# Altium schematic sheet sensorsAndExecutiveElements.SchDoc
size A4
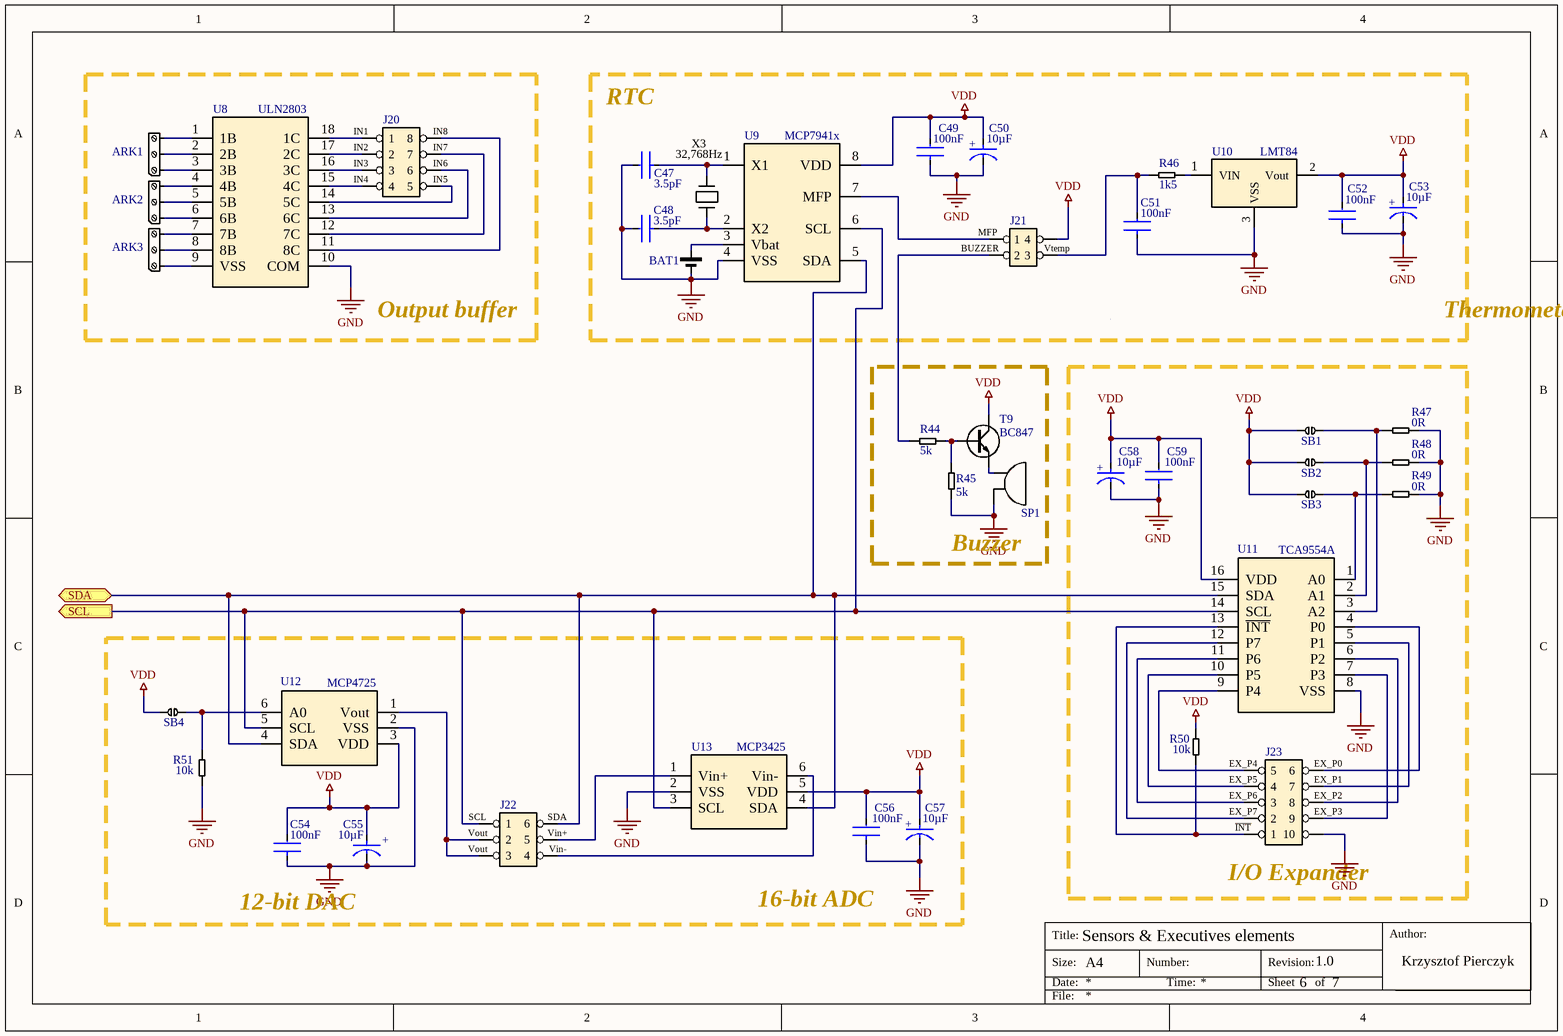
[diagram p0: sensorsAndExecutiveElements.SchDoc]

## Parts
ARK1  ARK-3  [ARK3]  (value not drawn)
ARK2  ARK-3  [ARK3]  (value not drawn)
ARK3  ARK-3  [ARK3]  (value not drawn)
BAT1  Battery  [CR2032 Holder (botland)]  (value not drawn)
C47  value 3.5pF  [FP-C0805C-DN-MFG]  (hidden comment: C0805C102J5GACTU)
C48  value 3.5pF  [FP-C0805C-DN-MFG]  (hidden comment: C0805C102J5GACTU)
C49  value 100nF  [FP-C0805C-DN-MFG]  (hidden comment: C0805C102J5GACTU)
C50  Capacitance: 10µF  [FP-F98S-MFG]  (hidden comment: F981C106MSAAS1)
C51  value 100nF  [FP-C0805C-DN-MFG]  (hidden comment: C0805C102J5GACTU)
C52  value 100nF  [FP-C0805C-DN-MFG]  (hidden comment: C0805C102J5GACTU)
C53  Capacitance: 10µF  [FP-F98S-MFG]  (hidden comment: F981C106MSAAS1)
C54  value 100nF  [FP-C0805C-DN-MFG]  (hidden comment: C0805C102J5GACTU)
C55  Capacitance: 10µF  [FP-F98S-MFG]  (hidden comment: F981C106MSAAS1)
C56  value 100nF  [FP-C0805C-DN-MFG]  (hidden comment: C0805C102J5GACTU)
C57  Capacitance: 10µF  [FP-F98S-MFG]  (hidden comment: F981C106MSAAS1)
C58  Capacitance: 10µF  [FP-F98S-MFG]  (hidden comment: F981C106MSAAS1)
C59  value 100nF  [FP-C0805C-DN-MFG]  (hidden comment: C0805C102J5GACTU)
J20  Header 2x4  [Header 2x4]  (value not drawn)
J21  Header 2x2  [Header 2x2]  (value not drawn)
J22  Header 2x3  [Header 2x3]  (value not drawn)
J23  Header 2x5  [Header2x5]  (value not drawn)
R44  Resistance: 5k  [0805]  (hidden comment: Resistor)
R45  Resistance: 5k  [0805]  (hidden comment: Resistor)
R46  Resistance: 1k5  [0805]  (hidden comment: Resistor)
R47  Resistance: 0R  [0805]  (hidden comment: Resistor)
R48  Resistance: 0R  [0805]  (hidden comment: Resistor)
R49  Resistance: 0R  [0805]  (hidden comment: Resistor)
R50  Resistance: 10k  [0805]  (hidden comment: Resistor)
R51  Resistance: 10k  [0805]  (hidden comment: Resistor)
SB1  Bridge  [0805]  (value not drawn)
SB2  Bridge  [0805]  (value not drawn)
SB3  Bridge  [0805]  (value not drawn)
SB4  Bridge  [0805]  (value not drawn)
SP1  Buzzer  [Buzzer 3-16V (botland)]  (value not drawn)
T9  BC847  [SOT-23-3]
U8  ULN2803  [SOIC-18 (300MIL)]
U9  MCP7941x  [SOIC-8]
U10  LMT84  [TO-92 (STRAIGHT)]
U11  TCA9554A  [TSSOP-16]
U12  MCP4725  [SOT-23-6]
U13  MCP3425  [SOT-23-6]
X3  Frequency: 32,768Hz  [X32K768S315]  (hidden comment: Crystal)

## Blocks framed on the sheet
Output buffer: ARK1-ARK3 J20 U8
Buzzer: R44 R45 SP1 T9
I/O Expander: C58 C59 J23 R47-R50 SB1-SB3 U11

## Ports
SCL (out), SDA (bidir)

## Nets
GND: BAT1.2(-) C47.2 C48.2 C49.1 C50.1(C) C51.1 C52.1 C53.1(C) C54.1 C55.1(C) C56.1 C57.1(C) C58.1(C) C59.1 J23.10 R45.1 R47.1 R48.1 R49.1 R51.2 SP1.2 U8.10(COM) U9.4(VSS) U10.3(VSS) U11.8(VSS) U12.2(VSS) U13.2(VSS)
VDD: C49.2 C50.2(A) C52.2 C53.2(A) C54.2 C55.2(A) C56.2 C57.2(A) C58.2(A) C59.2 J21.4 R50.2 SB1.1 SB2.1 SB3.1 SB4.1 T9.3(C) U9.8(VDD) U10.2(Vout) U11.16(VDD) U12.3(VDD) U13.5(VDD)
BUZZER: J21.2 R44.1
EX_P0: J23.6 U11.4(P0)
EX_P1: J23.7 U11.5(P1)
EX_P2: J23.8 U11.6(P2)
EX_P3: J23.9 U11.7(P3)
EX_P4: J23.5 U11.9(P4)
EX_P5: J23.4 U11.10(P5)
EX_P6: J23.3 U11.11(P6)
EX_P7: J23.2 U11.12(P7)
~{INT}: J23.1 R50.1 U11.13(~{INT})
IN1: J20.1 U8.18(1C)
IN2: J20.2 U8.17(2C)
IN3: J20.3 U8.16(3C)
IN4: J20.4 U8.15(4C)
IN5: J20.5 U8.14(5C)
IN6: J20.6 U8.13(6C)
IN7: J20.7 U8.12(7C)
IN8: J20.8 U8.11(8C)
MFP: J21.1 U9.7(MFP)
SCL: J22.1 U9.6(SCL) U11.14(SCL) U12.5(SCL) U13.3(SCL) ; port SCL
SDA: J22.6 U9.5(SDA) U11.15(SDA) U12.4(SDA) U13.4(SDA) ; port SDA
Vin+: J22.5 U13.1(Vin+)
Vin-: J22.4 U13.6(Vin-)
Vout: J22.2 J22.3 U12.1(Vout)
Vtemp: C51.2 J21.3 R46.2
NetARK1_1: ARK1.1 U8.3(3B)
NetARK1_2: ARK1.2 U8.2(2B)
NetARK1_3: ARK1.3 U8.1(1B)
NetARK2_1: ARK2.1 U8.6(6B)
NetARK2_2: ARK2.2 U8.5(5B)
NetARK2_3: ARK2.3 U8.4(4B)
NetARK3_1: ARK3.1 U8.9(VSS)
NetARK3_2: ARK3.2 U8.8(8B)
NetARK3_3: ARK3.3 U8.7(7B)
NetBAT1_1: BAT1.1(+) U9.3(Vbat)
NetC47_1: C47.1 U9.1(X1) X3.1
NetC48_1: C48.1 U9.2(X2) X3.2
NetR44_2: R44.2 R45.2 T9.1(B)
NetR46_1: R46.1 U10.1(VIN)
NetR47_2: R47.2 SB1.2 U11.3(A2)
NetR48_2: R48.2 SB2.2 U11.2(A1)
NetR49_2: R49.2 SB3.2 U11.1(A0)
NetR51_1: R51.1 SB4.2 U12.6(A0)
NetSP1_1: SP1.1 T9.2(E)

## Notes on the sheet
- (near C47) RTC
- Thermometer
- 12-bit DAC
- 16-bit ADC
- Sensors & Executives elements
- 6
- 1.0
- 7
- Title:
- Size:
- Date:
- A4
- Number:
- Time:
- Revision:
- Sheet
- of
- Author:
- Krzysztof Pierczyk
- File:
- (in symbol CMP-04424-000018-1) +

## Library data of the parts
C47-C49 C51 C52 C54 C56 C59 = CMP-03020-008364-1: CAP CER 1000PF 50V C0G/NP0 0805; Manufacturer: KEMET; Capacitance: 1,000 pF; Temperature Characteristic: C0G; Material: Ceramic; Temperature Coefficient: 30ppm/°C; Tolerance: 0.05; Automotive: No; Voltage Rating: 50 V; Device Class L1: Passive Components; Digikey Description: CAP CER 1000PF 50V C0G/NP0 0805; Lead Free: Yes; Package: C0805C-DN; RoHS: TRUE; Temperature Range High: +125°C; Height: 0.88mm; Ipc Land Pattern Name: CAPC200125X78; Category: Cap; ComponentLink2URL: https://content.kemet.com/datasheets/KEM_C1003_C0G_SMD.pdf; Device Class L2: Capacitors; ComponentLink2Description: Datasheet; Temperature: -55°C to +125°C; Octopart: https://octopart.com/c0805c102j5gactu-kemet-97757; Mouser Description: Multilayer Ceramic Capacitors MLCC - SMD/SMT 50volts 1000pF C0G 5%; Manufacturer Part Number: C0805C102J5GACTU; Device Class L3: Ceramic Capacitors; Temperature Range Low: -55°C
C50 C53 C55 C57 C58 = CMP-04424-000018-1: CAP TANT 10UF 20% 16V 0805; Manufacturer: AVX; Esr: 4.5Ω; Material: Tantalum; Ripple Current: 100mA; Leakage Current: 1.6uA; Life: 1000Hours; Dissipation Factor: 18%; Temperature Range High: +125°C; Temperature: -55°C to +125°C; Digikey Description: CAP TANT 10UF 20% 16V 0805; Tolerance: 20%; Automotive: No; Voltage Rating: 16V; Device Class L3: Tantalum Capacitors; Package: F98S; Device Class L2: Capacitors; Footprint Url: https://www.avx.com/download/software/literature/AVX-Footprint-Library.pdf; Mouser Description: Cap Tant Solid 10uF 16V S CASE 20% (2 x 1.25 x 0.8mm) SMD 2012-09 4.5Ohm 125°C T/R; Value: 10uF; ComponentLink2URL: http://datasheets.avx.com/F98-AS1.pdf; Height: 0.9mm; Manufacturer Part Number: F981C106MSAAS1; ComponentLink2Description: Datasheet; Lead Free: Yes; Category: Cap; Temperature Coefficient: 20%; RoHS: TRUE; Temperature Range Low: -55°C; Octopart: https://octopart.com/f981c106msaas1-avx-49645945; Device Class L1: Passive Components
R44-R51 = Resistor: Nominal power: 125mW
U8 = ULN2803: Vce: 50V; Vi: 30V; Iec: 500mA; ComponentLink1Description: Datasheet; ComponentLink1URL: http://www.ti.com/lit/ds/symlink/uln2803a.pdf?&ts=1589632455566
U9 = MCP7941x: VDD (min): 1.8V; VDD (max): 5.5V; ComponentLink1Description: Datasheet; ComponentLink1URL: http://ww1.microchip.com/downloads/en/DeviceDoc/22266B.pdf
U10 = LMT84: VDD (min): 1.5V; VDD (max): 5.5V; IDD: 9uA; ComponentLink1Description: Datasheet; ComponentLink1URL: http://www.ti.com/lit/ds/symlink/lmt84.pdf?&ts=1589637241911
U11 = TCA9554A: VDD (min): 1.65V; VDD (max): 5.5V; ICC: 80mA; ComponentLink1Description: Datasheet; ComponentLink1URL: http://www.ti.com/lit/ds/symlink/tca9554a.pdf?&ts=1589634702475
U12 = MCP4725: VDD (min): 2.7V; VDD (max): 5.5V; ICC (max): 400uA; ComponentLink1Description: Datasheet; ComponentLink1URL: http://ww1.microchip.com/downloads/en/devicedoc/22039d.pdf
U13 = MCP3425: VDD (min): 2.7V; VDD (max): 5.5V; ICC (max): 400uA; ComponentLink1Description: Datasheet; ComponentLink1URL: https://ww1.microchip.com/downloads/en/DeviceDoc/22072b.pdf
T9 = BC847: ComponentLink1Description: Datasheet; ComponentLink1URL: https://assets.nexperia.com/documents/data-sheet/BC856_BC857_BC858.pdf
X3 = Crystal: ComponentLink1Description: Datasheet; ComponentLink1URL: https://www.4timing.com/specification/hc49smp.pdf